# Altium schematic sheet Motor-Driver-Sheet.SchDoc
size 420 x 297 mm; SheetNumber: 4; SheetTotal: 7
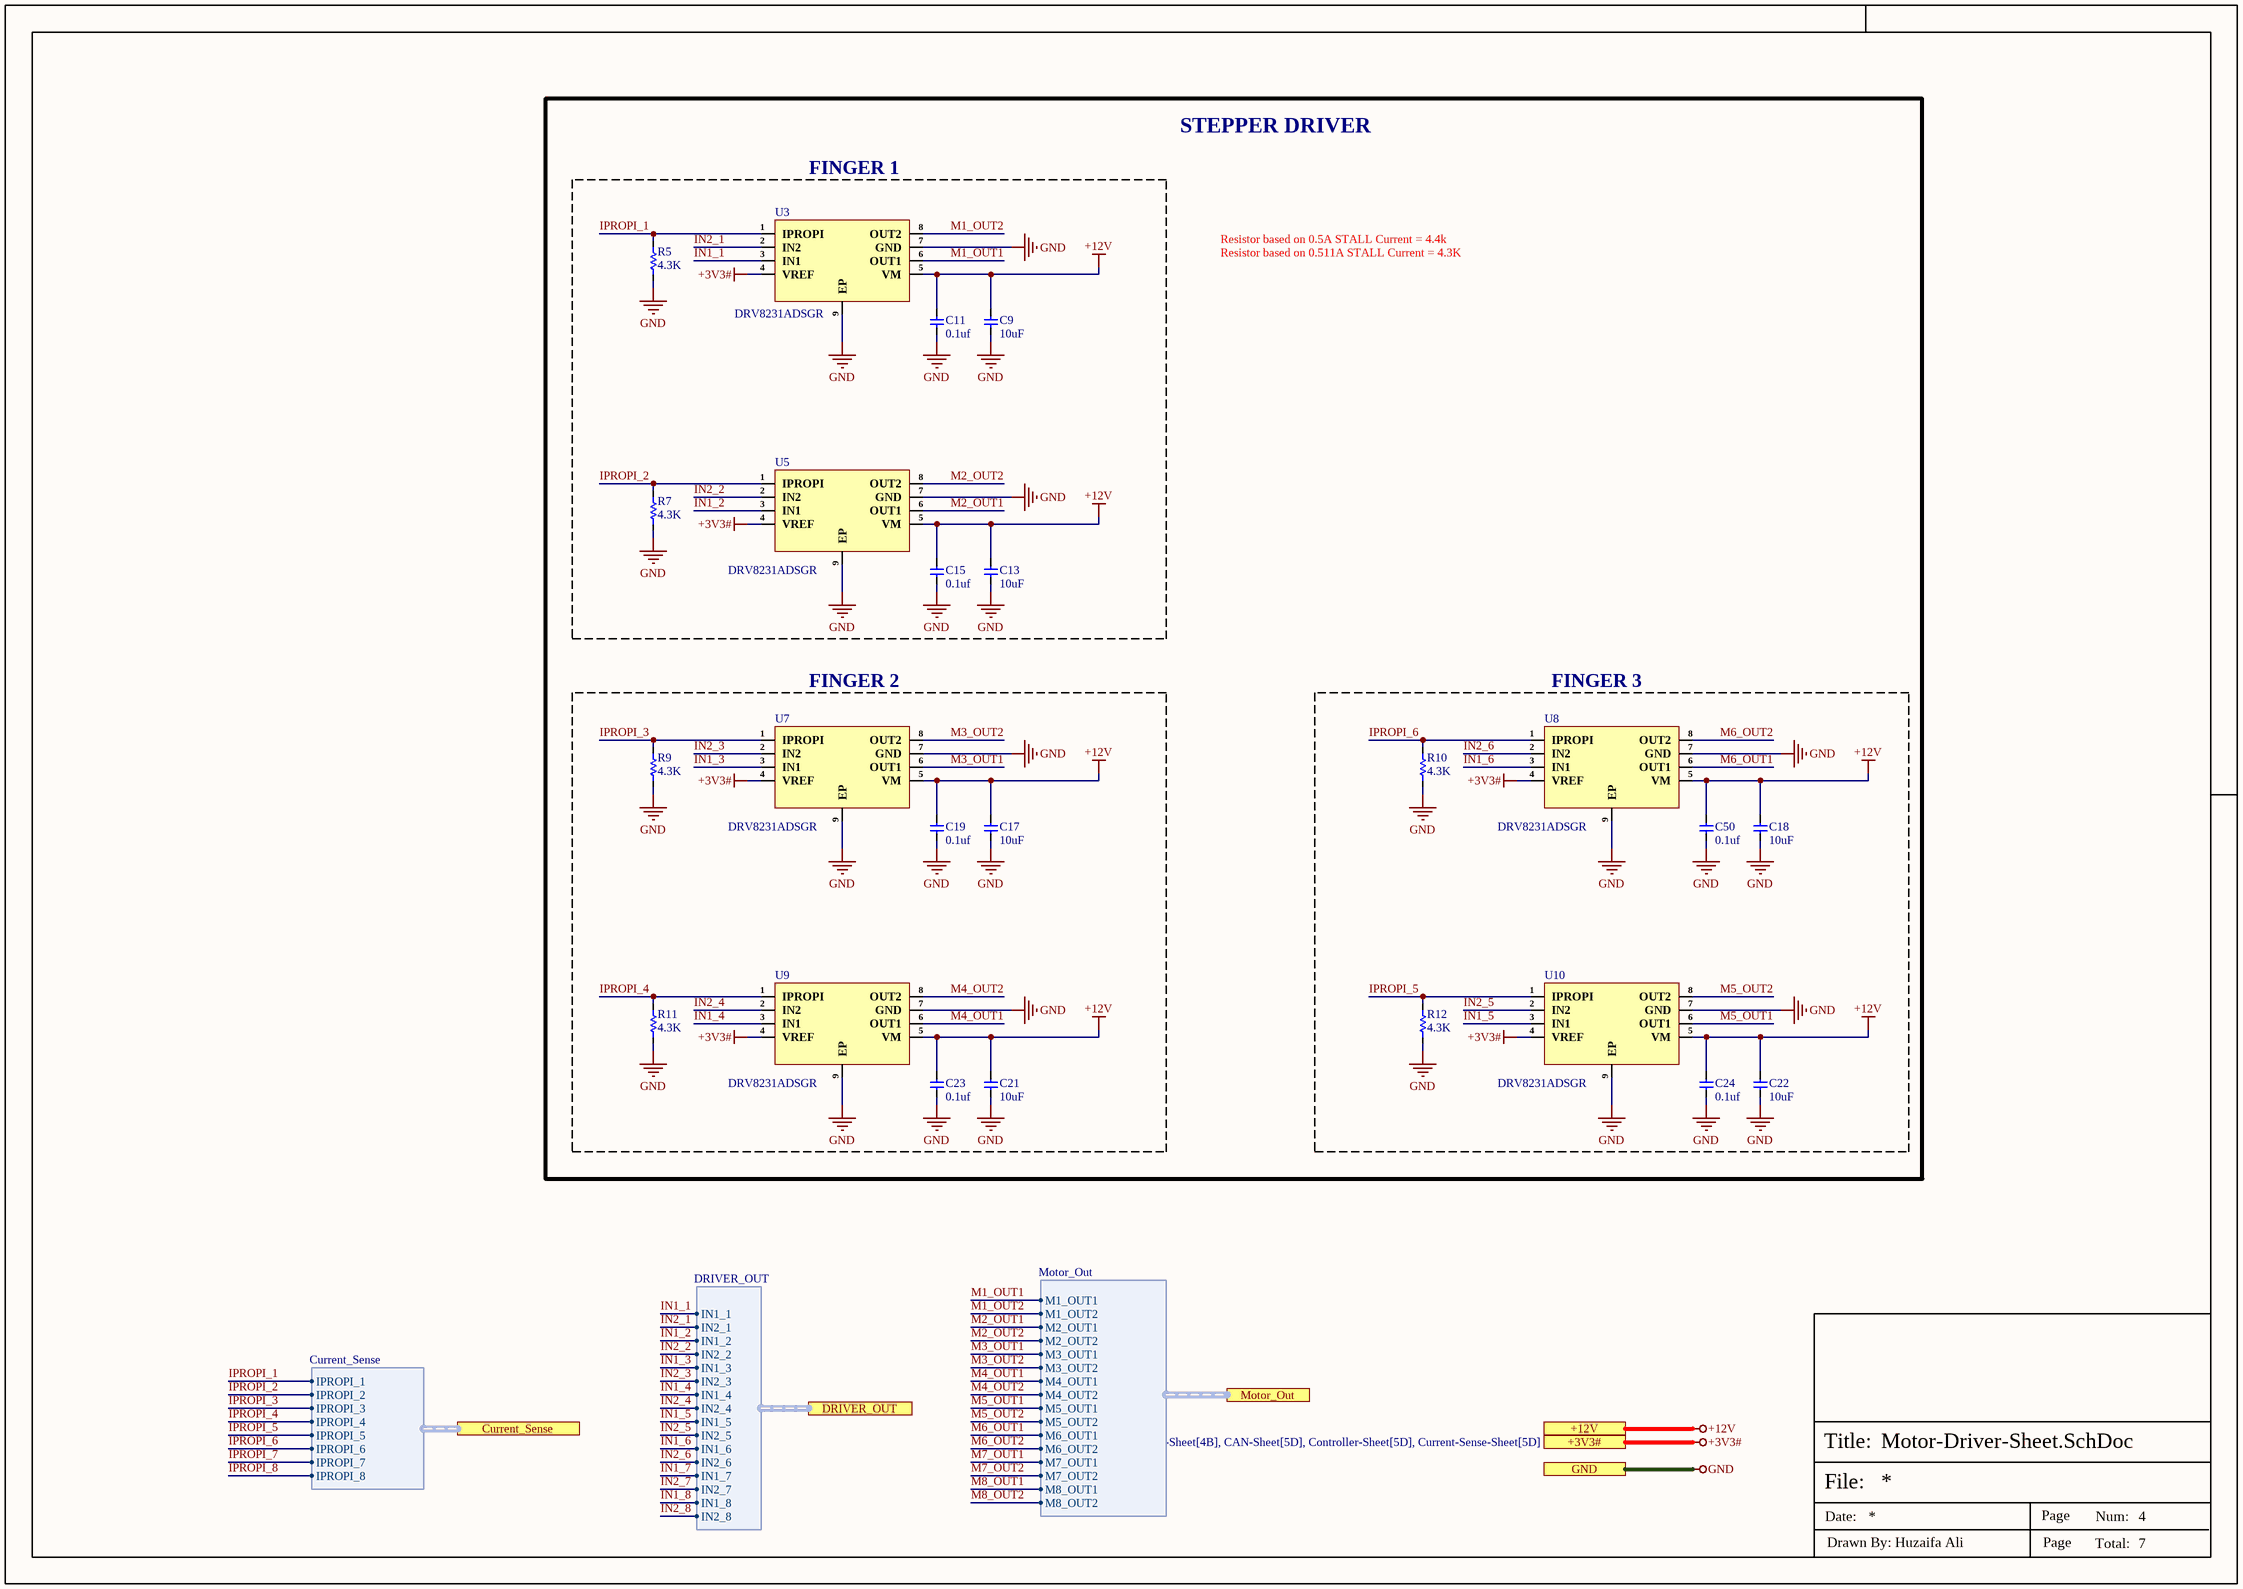
[diagram p0: Motor-Driver-Sheet.SchDoc]

## Parts
C9  10uF  [Cap-0603]
C11  0.1uf  [Cap-0402]
C13  10uF  [Cap-0603]
C15  0.1uf  [Cap-0402]
C17  10uF  [Cap-0603]
C18  10uF  [Cap-0603]
C19  0.1uf  [Cap-0402]
C21  10uF  [Cap-0603]
C22  10uF  [Cap-0603]
C23  0.1uf  [Cap-0402]
C24  0.1uf  [Cap-0402]
C50  0.1uf  [Cap-0402]
R5  4.3K  [Res-0402]
R7  4.3K  [Res-0402]
R9  4.3K  [Res-0402]
R10  4.3K  [Res-0402]
R11  4.3K  [Res-0402]
R12  4.3K  [Res-0402]
U3  DRV8231ADSGR  [WSON-8(2x2)]
U5  DRV8231ADSGR  [WSON-8(2x2)]
U7  DRV8231ADSGR  [WSON-8(2x2)]
U8  DRV8231ADSGR  [WSON-8(2x2)]
U9  DRV8231ADSGR  [WSON-8(2x2)]
U10  DRV8231ADSGR  [WSON-8(2x2)]

## Blocks framed on the sheet
FINGER 1: C9 C11 C13 C15 R5 R7 U3 U5
FINGER 2: C17 C19 C21 C23 R9 R11 U7 U9
FINGER 3: C18 C22 C24 C50 R10 R12 U8 U10

## Ports
+3V3# (see Top-Sheet[4B], CAN-Sheet[5D], Controller-Sheet[5D], Current-Sense-Sheet[5D]), +12V (see Top-Sheet[4B], Connector-Sheet[5D]), Current_Sense (harness Current_Sense, see Top-Sheet[5B], Current-Sense-Sheet[2D]), DRIVER_OUT (harness DRIVER_OUT, see Top-Sheet[4B], Controller-Sheet[2D]), GND (see Top-Sheet[4B], CAN-Sheet[5D], Connector-Sheet[5D], Controller-Sheet[5D], Current-Sense-Sheet[5D], Motor-Connector[5D]), Motor_Out (harness Motor_Out, see Top-Sheet[4B], Motor-Connector[4D])

## Harnesses
Current_Sense: IPROPI_1, IPROPI_2, IPROPI_3, IPROPI_4, IPROPI_5, IPROPI_6, IPROPI_7, IPROPI_8
Motor_Out: M1_OUT1, M1_OUT2, M2_OUT1, M2_OUT2, M3_OUT1, M3_OUT2, M4_OUT1, M4_OUT2, M5_OUT1, M5_OUT2, M6_OUT1, M6_OUT2, M7_OUT1, M7_OUT2, M8_OUT1, M8_OUT2
DRIVER_OUT: IN1_1, IN2_1, IN1_2, IN2_2, IN1_3, IN2_3, IN1_4, IN2_4, IN1_5, IN2_5, IN1_6, IN2_6, IN1_7, IN2_7, IN1_8, IN2_8

## Nets
+3V3#: U3.4(VREF) U5.4(VREF) U7.4(VREF) U8.4(VREF) U9.4(VREF) U10.4(VREF) ; port +3V3#
+12V: C9.2 C11.2 C13.2 C15.2 C17.2 C18.2 C19.2 C21.2 C22.2 C23.2 C24.2 C50.2 U3.5(VM) U5.5(VM) U7.5(VM) U8.5(VM) U9.5(VM) U10.5(VM) ; port +12V
GND: C9.1 C11.1 C13.1 C15.1 C17.1 C18.1 C19.1 C21.1 C22.1 C23.1 C24.1 C50.1 R5.1 R7.1 R9.1 R10.1 R11.1 R12.1 U3.7(GND) U3.9(EP) U5.7(GND) U5.9(EP) U7.7(GND) U7.9(EP) U8.7(GND) U8.9(EP) U9.7(GND) U9.9(EP) U10.7(GND) U10.9(EP) ; port GND
IN1_1: U3.3(IN1) ; port DRIVER_OUT.IN1_1
IN1_2: U5.3(IN1) ; port DRIVER_OUT.IN1_2
IN1_3: U7.3(IN1) ; port DRIVER_OUT.IN1_3
IN1_4: U9.3(IN1) ; port DRIVER_OUT.IN1_4
IN1_5: U10.3(IN1) ; port DRIVER_OUT.IN1_5
IN1_6: U8.3(IN1) ; port DRIVER_OUT.IN1_6
IN1_7: port DRIVER_OUT.IN1_7
IN1_8: port DRIVER_OUT.IN1_8
IN2_1: U3.2(IN2) ; port DRIVER_OUT.IN2_1
IN2_2: U5.2(IN2) ; port DRIVER_OUT.IN2_2
IN2_3: U7.2(IN2) ; port DRIVER_OUT.IN2_3
IN2_4: U9.2(IN2) ; port DRIVER_OUT.IN2_4
IN2_5: U10.2(IN2) ; port DRIVER_OUT.IN2_5
IN2_6: U8.2(IN2) ; port DRIVER_OUT.IN2_6
IN2_7: port DRIVER_OUT.IN2_7
IN2_8: port DRIVER_OUT.IN2_8
IPROPI_1: R5.2 U3.1(IPROPI) ; port Current_Sense.IPROPI_1
IPROPI_2: R7.2 U5.1(IPROPI) ; port Current_Sense.IPROPI_2
IPROPI_3: R9.2 U7.1(IPROPI) ; port Current_Sense.IPROPI_3
IPROPI_4: R11.2 U9.1(IPROPI) ; port Current_Sense.IPROPI_4
IPROPI_5: R12.2 U10.1(IPROPI) ; port Current_Sense.IPROPI_5
IPROPI_6: R10.2 U8.1(IPROPI) ; port Current_Sense.IPROPI_6
IPROPI_7: port Current_Sense.IPROPI_7
IPROPI_8: port Current_Sense.IPROPI_8
M1_OUT1: U3.6(OUT1) ; port Motor_Out.M1_OUT1
M1_OUT2: U3.8(OUT2) ; port Motor_Out.M1_OUT2
M2_OUT1: U5.6(OUT1) ; port Motor_Out.M2_OUT1
M2_OUT2: U5.8(OUT2) ; port Motor_Out.M2_OUT2
M3_OUT1: U7.6(OUT1) ; port Motor_Out.M3_OUT1
M3_OUT2: U7.8(OUT2) ; port Motor_Out.M3_OUT2
M4_OUT1: U9.6(OUT1) ; port Motor_Out.M4_OUT1
M4_OUT2: U9.8(OUT2) ; port Motor_Out.M4_OUT2
M5_OUT1: U10.6(OUT1) ; port Motor_Out.M5_OUT1
M5_OUT2: U10.8(OUT2) ; port Motor_Out.M5_OUT2
M6_OUT1: U8.6(OUT1) ; port Motor_Out.M6_OUT1
M6_OUT2: U8.8(OUT2) ; port Motor_Out.M6_OUT2
M7_OUT1: port Motor_Out.M7_OUT1
M7_OUT2: port Motor_Out.M7_OUT2
M8_OUT1: port Motor_Out.M8_OUT1
M8_OUT2: port Motor_Out.M8_OUT2

## Notes on the sheet
- STEPPER DRIVER
- Resistor based on 0.5A STALL Current = 4.4k
- Resistor based on 0.511A STALL Current = 4.3K
- File:
- Title:
- Date:
- Page
- Num:
- Total:
- Drawn By: Huzaifa Ali

## Library data of the parts
C9 C13 C17 C18 C21 C22 = GRM188R61E106KA73D: CAP CER 10UF 25V X5R 0603; Manufacturer: Murata; Supplier 1: Mouser; Manufacturer Part Number: GRM188R61E106KA73D; RoHS: Yes; Category: Ceramic Capacitors; Stock 1: 319428; Pricing 1: 1=0.36000, 10=0.25800, 50=0.25800, 100=0.15500, 1000=0.09800, 10000=0.06900 (USD); Case/Package: 0603; RoHS Compliant: Yes; ComponentLink1URL: https://search.murata.co.jp/Ceramy/image/img/A01X/G101/ENG/GRM188R61E106KA73-01.pdf?src-supplier=Digi-Key; ComponentLink1Description: https://search.murata.co.jp/Ceramy/image/img/A01X/G101/ENG/GRM188R61E106KA73-01.pdf?src-supplier=Digi-Key; Supplier Part Number 1: 81-GRM188R61E106KA3D; LCSC Part Number: C344022
C11 C15 C19 C23 C24 C50 = GRM155R62A104KE14D: CAP CER 0.1UF 100V X5R 0402; Manufacturer: Murata; Capacitance: 100nF; Tolerance: 10%; Item Type: Capacitor; Supplier 1: Arrow Electronics; Manufacturer Part Number: GRM155R62A104KE14D; RoHS: Yes; Category: Ceramic Capacitors; Stock 1: 870000; Pricing 1: 10000=0.00500, 20000=0.00410, 30000=0.00390, 50000=0.00370, 100000=0.00300 (USD); Mount: Surface Mount; Case/Package: 0402; Case Code (Metric): 1005; Case Code (Imperial): 0402; Weight: 0.000212oz; Min Operating Temperature: -55°C; Max Operating Temperature: 85°C; Packaging: Tape and Reel; Voltage Rating: 100V; Dielectric: X5R; Termination: SMD/SMT; Voltage Rating (DC): 100V; Package Quantity: 10000; Series: GRM; Length: 0.039inch; Width: 0.02inch; Height: 0.5mm; Thickness: 0.022inch; Reach SVHC Compliant: Yes; Lead Free: Lead Free; RoHS Compliant: Yes; ComponentLink1URL: http://www.farnell.com/datasheets/2079151.pdf?src-supplier=Farnell; ComponentLink1Description: http://www.farnell.com/datasheets/2079151.pdf?src-supplier=Farnell; ComponentLink2URL: http://www.mouser.com/ds/2/281/c02e-2905.pdf?src-supplier=Mouser; ComponentLink2Description: http://www.mouser.com/ds/2/281/c02e-2905.pdf?src-supplier=Mouser; ComponentLink3URL: http://www.farnell.com/datasheets/2079151.pdf?src-supplier=Element14; ComponentLink3Description: http://www.farnell.com/datasheets/2079151.pdf?src-supplier=Element14; ComponentLink4URL: http://search.murata.co.jp/Ceramy/image/img/A01X/G101/ENG/GRM155R62A104KE14-01.pdf?src-supplier=Digi-Key; ComponentLink4Description: http://search.murata.co.jp/Ceramy/image/img/A01X/G101/ENG/GRM155R62A104KE14-01.pdf?src-supplier=Digi-Key; ComponentLink5URL: http://www.farnell.com/datasheets/2079151.pdf?src-supplier=Newark; ComponentLink5Description: http://www.farnell.com/datasheets/2079151.pdf?src-supplier=Newark; Supplier Part Number 1: GRM155R62A104KE14D; LCSC Part Number: C162178
R5 R7 R9-R12 = 0402WGF4301TCE: 62.5mW Thick Film Resistors 50V ±100ppm/℃ ±1% 4.3kΩ 0402 Chip Resistor - Surface Mount ROHS; Manufacturer: Royal Electronic Factory; Value: 4.3kR; Temperature Coefficient: 100ppm/°C; Supplier: Mouser; Supplier Part Number: 303-0402WGF4301TCE; Manufacturer Part Number: 0402WGF4301TCE; RoHS: No; Item Type: Resistor; Pricing: 10000=0.004 (USD); ComponentLink1URL: http://datasheet.octopart.com/0402WGF4301TCE-Royal-Ohm-datasheet-17591902.pdf?src-supplier=Mouser; ComponentLink1Description: http://datasheet.octopart.com/0402WGF4301TCE-Royal-Ohm-datasheet-17591902.pdf?src-supplier=Mouser; ComponentLink2URL: https://datasheet.octopart.com/0402WGF4301TCE-Royal-Ohm-datasheet-165785611.pdf?src-supplier=TME; ComponentLink2Description: https://datasheet.octopart.com/0402WGF4301TCE-Royal-Ohm-datasheet-165785611.pdf?src-supplier=TME; LCSC Part Number: C25899
U3 U5 U7-U10 = DRV8231ADSGR: 33V H BRIDGE MOTOR DRIVER WITH C; Manufacturer: Texas Instruments; Item Type: IC; Number of Channels: 1NUMBER; Supplier: Mouser; Supplier Part Number: 595-DRV8231ADSGR; Manufacturer Part Number: DRV8231ADSGR; RoHS: No; Stock: 8609; Pricing: 1=1.52, 10=1.29, 50=1.29, 100=1.1, 1000=0.747, 10000=0.657 (USD); Pins: 8NUMBER; Length: 2mm; Width: 2mm; Height: 800um; Thickness: 750um; LCSC Part Number: C5139865